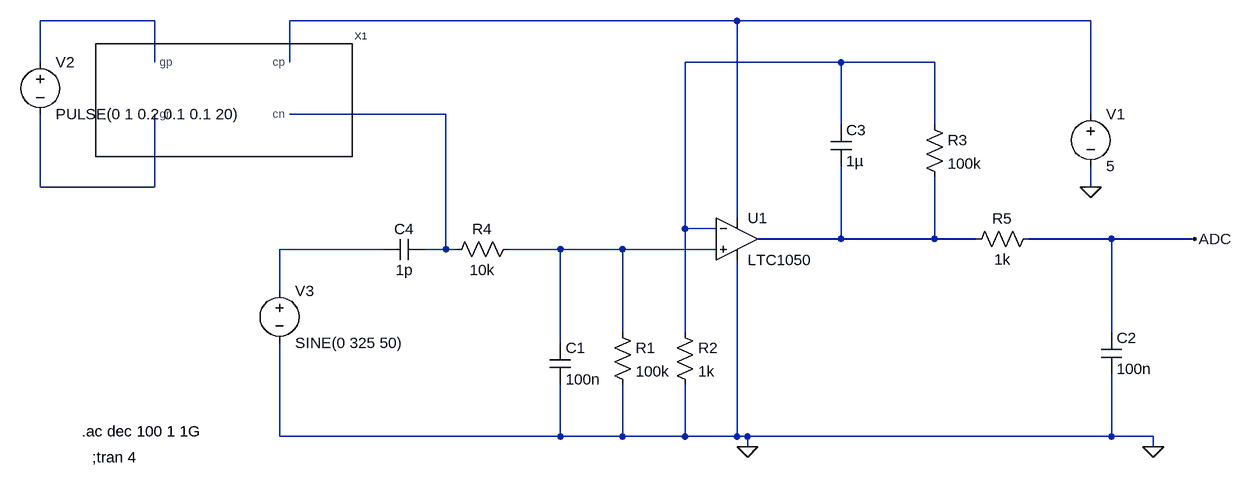
[diagram p0: schematic Draft3.asc]
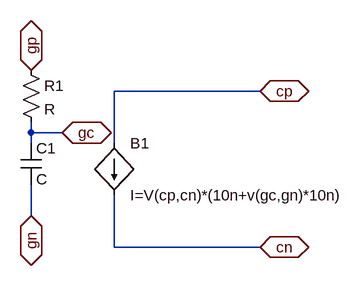
[diagram p1: sub-circuit symb_capteur.asc]
Draft3.asc, the LTspice schematic file:
Version 4
SHEET 1 880 680
WIRE -864 -336 -1040 -336
WIRE 32 -336 -656 -336
WIRE 576 -336 32 -336
WIRE -1040 -272 -1040 -336
WIRE -864 -272 -864 -336
WIRE -656 -272 -656 -336
WIRE 192 -272 -48 -272
WIRE 336 -272 192 -272
WIRE -416 -192 -656 -192
WIRE 576 -192 576 -336
WIRE 192 -176 192 -272
WIRE 336 -176 336 -272
WIRE -1040 -80 -1040 -192
WIRE -864 -80 -864 -192
WIRE -864 -80 -1040 -80
WIRE 576 -80 576 -112
WIRE 32 -32 32 -336
WIRE -48 -16 -48 -272
WIRE 0 -16 -48 -16
WIRE 192 0 192 -112
WIRE 192 0 64 0
WIRE 336 0 336 -96
WIRE 336 0 192 0
WIRE 400 0 336 0
WIRE 608 0 480 0
WIRE 736 0 608 0
WIRE -512 16 -672 16
WIRE -416 16 -416 -192
WIRE -416 16 -448 16
WIRE -400 16 -416 16
WIRE -240 16 -320 16
WIRE -144 16 -240 16
WIRE 0 16 -144 16
WIRE -672 80 -672 16
WIRE -144 144 -144 16
WIRE -48 144 -48 -16
WIRE 608 144 608 0
WIRE -240 160 -240 16
WIRE -672 304 -672 160
WIRE -240 304 -240 224
WIRE -240 304 -672 304
WIRE -144 304 -144 224
WIRE -144 304 -240 304
WIRE -48 304 -48 224
WIRE -48 304 -144 304
WIRE 32 304 32 32
WIRE 32 304 -48 304
WIRE 48 304 32 304
WIRE 608 304 608 208
WIRE 608 304 48 304
WIRE 672 304 608 304
WIRE 48 320 48 304
WIRE 672 320 672 304
FLAG 48 320 0
FLAG 672 320 0
FLAG 576 -80 0
FLAG 736 0 ADC
SYMBOL res -160 128 R0
SYMATTR InstName R1
SYMATTR Value 100k
SYMBOL res -64 128 R0
SYMATTR InstName R2
SYMATTR Value 1k
SYMBOL res 320 -192 R0
SYMATTR InstName R3
SYMATTR Value 100k
SYMBOL res -304 0 R90
WINDOW 0 0 56 VBottom 2
WINDOW 3 32 56 VTop 2
SYMATTR InstName R4
SYMATTR Value 10k
SYMBOL res 496 -16 R90
WINDOW 0 0 56 VBottom 2
WINDOW 3 32 56 VTop 2
SYMATTR InstName R5
SYMATTR Value 1k
SYMBOL cap -256 160 R0
SYMATTR InstName C1
SYMATTR Value 100n
SYMBOL cap 592 144 R0
SYMATTR InstName C2
SYMATTR Value 100n
SYMBOL cap 176 -176 R0
SYMATTR InstName C3
SYMATTR Value 1µ
SYMBOL OpAmps\\LTC1050 32 -64 R0
SYMATTR InstName U1
SYMBOL voltage 576 -208 R0
SYMATTR InstName V1
SYMATTR Value 5
SYMBOL symb_capteur -736 -224 R0
SYMATTR InstName X1
SYMBOL cap -448 0 R90
WINDOW 0 0 32 VBottom 2
WINDOW 3 32 32 VTop 2
SYMATTR InstName C4
SYMATTR Value 1p
SYMBOL voltage -1040 -288 R0
WINDOW 123 0 0 Left 0
WINDOW 39 0 0 Left 0
SYMATTR InstName V2
SYMATTR Value PULSE(0 1 0.2 0.1 0.1 20)
SYMBOL voltage -672 64 R0
WINDOW 123 0 0 Left 0
WINDOW 39 0 0 Left 0
SYMATTR InstName V3
SYMATTR Value SINE(0 325 50)
TEXT -960 336 Left 2 !;tran 4
TEXT -976 296 Left 2 !.ac dec 100 1 1G

symb_capteur.asc, the sub-circuit schematic file:
Version 4
SHEET 1 880 680
WIRE 304 32 80 32
WIRE -48 96 -48 80
WIRE 0 96 -48 96
WIRE -48 112 -48 96
WIRE 80 112 80 32
WIRE -48 224 -48 176
WIRE 80 272 80 192
WIRE 304 272 80 272
FLAG 304 32 cp
IOPIN 304 32 BiDir
FLAG 304 272 cn
IOPIN 304 272 BiDir
FLAG -48 0 gp
IOPIN -48 0 BiDir
FLAG -48 224 gn
IOPIN -48 224 BiDir
FLAG 0 96 gc
IOPIN 0 96 BiDir
SYMBOL bi 80 112 R0
SYMATTR InstName B1
SYMATTR Value I=V(cp,cn)*(10n+v(gc,gn)*10n)
SYMBOL cap -64 112 R0
SYMATTR InstName C1
SYMBOL res -64 -16 R0
SYMATTR InstName R1

The netlist it stands for:
* Draft3.asc
R1 N008 0 100k
R2 N003 0 1k
R3 N003 N006 100k
R4 N008 N004 10k
R5 ADC N006 1k
C1 N008 0 100n
C2 ADC 0 100n
C3 N003 N006 1µ
XU1 N008 N003 N002 0 N006 LTC1050  ; pins In+ In- V+ V- OUT
V1 N002 0 5
XX1 N002 N005 N001 N004 symb_capteur
C4 N004 N007 1p
V2 N001 N005 PULSE(0 1 0.2 0.1 0.1 20)
V3 N007 0 SINE(0 325 50)

* block symbol definitions
.subckt symb_capteur cp gn gp cn
B1 cp cn I=V(cp,cn)*(10n+v(gc,gn)*10n)
C1 gc gn C
R1 gp gc R
.ends symb_capteur

;tran 4
.ac dec 100 1 1G
.lib LTC.lib
.backanno
.end